# EAGLE design servo-pwm (EAGLE 7.0.0)
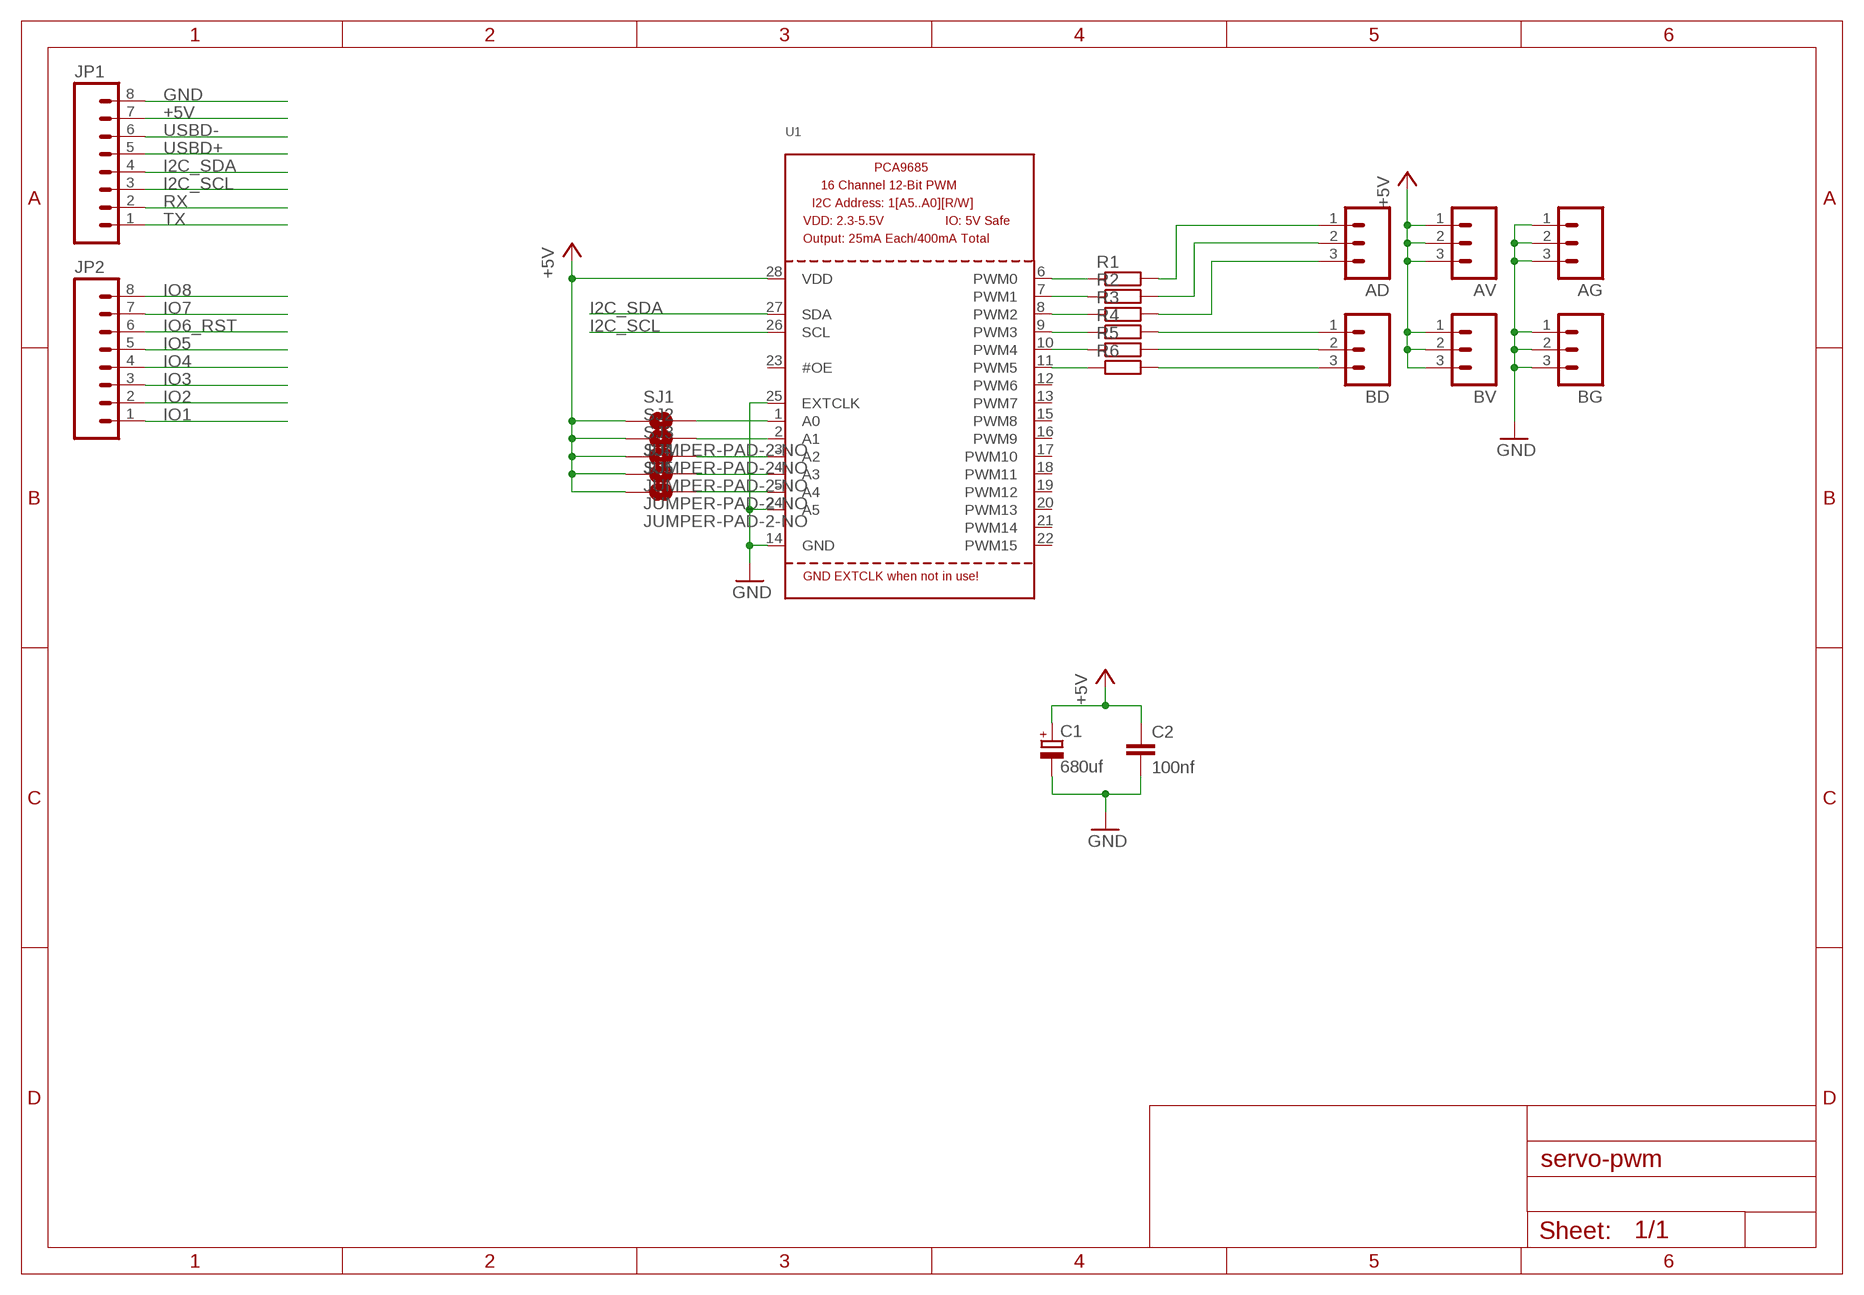
[diagram p0: schematic, sheet 1]

## Parts
AD  M03LOCK  [1X03_LOCK]
AG  M03LOCK  [1X03_LOCK]
AV  M03LOCK  [1X03_LOCK]
BD  M03LOCK  [1X03_LOCK]
BG  M03LOCK  [1X03_LOCK]
BV  M03LOCK  [1X03_LOCK]
C1  680uf  CPOL-EUE2.5-7  [E2,5-7]
C2  100nf  C-EU025-030X050  [C025-030X050]
JP1  M081X08  [1X08]
JP2  M081X08  [1X08]
R1  R-EU_M0805  [M0805]
R2  R-EU_M0805  [M0805]
R3  R-EU_M0805  [M0805]
R4  R-EU_M0805  [M0805]
R5  R-EU_M0805  [M0805]
R6  R-EU_M0805  [M0805]
SJ1  JUMPER-PAD-2-NO  [PAD-JUMPER-2-NO_NO_SILK]
SJ2  JUMPER-PAD-2-NO  [PAD-JUMPER-2-NO_NO_SILK]
SJ3  JUMPER-PAD-2-NO  [PAD-JUMPER-2-NO_NO_SILK]
SJ4  JUMPER-PAD-2-NO  [PAD-JUMPER-2-NO_NO_SILK]
SJ5  JUMPER-PAD-2-NO  [PAD-JUMPER-2-NO_NO_SILK]
U1  PCA9685  [TSSOP28]

## Nets
+5V: AV.1 AV.2 AV.3 BV.1 BV.2 BV.3 C1.+ C2.1 JP1.7 SJ1.1 SJ2.1 SJ3.1 SJ4.1 SJ5.1 U1.28(VDD)
GND: AG.1 AG.2 AG.3 BG.1 BG.2 BG.3 C1.- C2.2 JP1.8 U1.14(GND) U1.24(A5) U1.25(EXTCLK)
I2C_SCL: JP1.3 U1.26(SCL)
I2C_SDA: JP1.4 U1.27(SDA)
IO1: JP2.1
IO2: JP2.2
IO3: JP2.3
IO4: JP2.4
IO5: JP2.5
IO6_RST: JP2.6
IO7: JP2.7
IO8: JP2.8
N$1: R4.1 U1.9(PWM3)
N$2: R5.1 U1.10(PWM4)
N$3: R6.1 U1.11(PWM5)
N$5: BD.3 R6.2
N$6: AD.3 R3.2
N$7: AD.2 R2.2
N$8: AD.1 R1.2
N$9: BD.2 R5.2
N$10: BD.1 R4.2
N$11: SJ1.2 U1.1(A0)
N$12: SJ2.2 U1.2(A1)
N$13: SJ5.2 U1.5(A4)
N$14: SJ3.2 U1.3(A2)
N$15: SJ4.2 U1.4(A3)
N$33: R3.1 U1.8(PWM2)
N$34: R2.1 U1.7(PWM1)
N$35: R1.1 U1.6(PWM0)
RX: JP1.2
TX: JP1.1
USBD+: JP1.5
USBD-: JP1.6
Unconnected: U1.12(PWM6) U1.13(PWM7) U1.15(PWM8) U1.16(PWM9) U1.17(PWM10) U1.18(PWM11) U1.19(PWM12) U1.20(PWM13) U1.21(PWM14) U1.22(PWM15) U1.23(#OE)

## Library data of the parts
AD AG AV BD BG BV = SparkFun-Connectors:M03: Header 3 Standard 3-pin 0.1" header. Use with straight break away headers (SKU : PRT-00116), right angle break away headers (PRT-00553), swiss pins (PRT-00743), machine pins (PRT-00117), and female headers (PRT-00115). Molex polarized connector foot print use with SKU : PRT-08232 with associated crimp pins and housings.
C1 = rcl:CPOL-EU: POLARIZED CAPACITOR, European symbol
C2 = rcl:C-EU: CAPACITOR, European symbol
JP1 JP2 = SparkFun-Connectors:M08: Header 8 Standard 8-pin 0.1" header. Use with straight break away headers (SKU : PRT-00116), right angle break away headers (PRT-00553), swiss pins (PRT-00743), machine pins (PRT-00117), and female headers (PRT-00115).
R1-R6 = rcl:R-EU_: RESISTOR, European symbol
SJ1-SJ5 = SparkFun-Passives:JUMPER-PAD-2-NO
U1 = adafruit:PCA9685: PCA9685 - 16 Channel 12-Bit I2C PWM Controller 5.0V tolerant 16 channel, 12-bit I2C PWM controller with 25mA per output (max. 400mA total) Digikey: 568-5931-1-ND

## Board
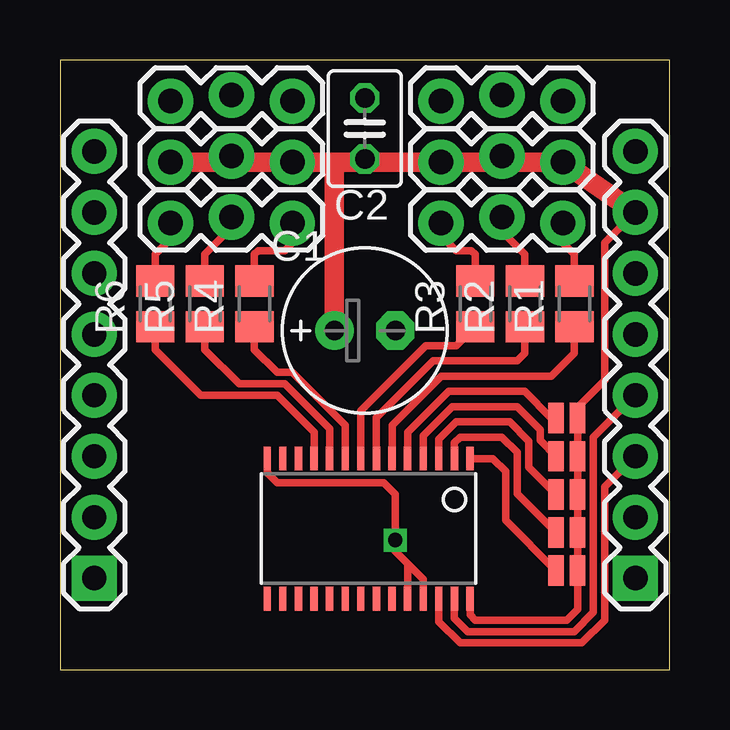
[diagram p1: board, top side]
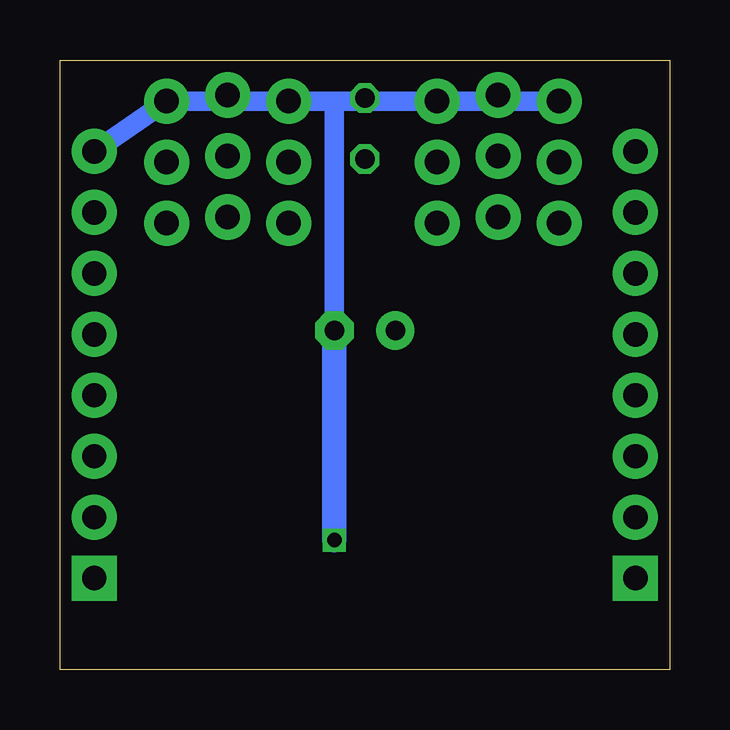
[diagram p2: board, bottom side, seen from below]

Size 25.4 x 25.4 mm. Coordinates in mm from the lower left corner, seen from the top.
Outline: 0,0 25.4,0 25.4,25.4 0,25.4 0,0
Copper layers (1*16): Top 0.0356mm / dielectric 1.5011mm / Bottom 0.0356mm
Design rules "LaenPCBOrder": minimum track width 6mil, minimum drill 13mil, track to track 6mil, track to pad 6mil, pad to pad 6mil, via to via 6mil, smd to smd 6mil, copper to edge 15mil, drill to drill 6mil, minimum pad ring 7mil, minimum via ring 7mil, stop-mask expansion 3mil, vias tented up to drill 0mil, thermal gap 10mil

### Footprints (pad centres in the part's own frame; a part is rotated, then mirrored left to right if it is on the bottom)
1X03_LOCK = drill 1.016 pad 1.88: 1 0,0.127; 2 2.54,-0.127; 3 5.08,0.127
E2,5-7 = drill 0.813 pad 1.6: + -1.27,0 | drill 0.813 pad 1.6 octagon: - 1.27,0
C025-030X050 = drill 0.813 octagon: 1 -1.27,0; 2 1.27,0
1X08 = drill 1.016 pad 1.88 square: 1 0,0 | drill 1.016 pad 1.88: 2 2.54,0; 3 5.08,0; 4 7.62,0; 5 10.16,0; 6 12.7,0; 7 15.24,0; 8 17.78,0
M0805 = smd 1.3 x 1.6: 1 -0.95,0; 2 0.95,0
PAD-JUMPER-2-NO_NO_SILK = smd 0.635 x 1.27: 1 -0.45,0; 2 0.45,0
TSSOP28 = smd 0.305 x 0.991: 1 -4.225,-2.918; 2 -3.575,-2.918; 3 -2.925,-2.918; 4 -2.275,-2.918; 5 -1.625,-2.918; 6 -0.975,-2.918; 7 -0.325,-2.918; 8 0.325,-2.918; 9 0.975,-2.918; 10 1.625,-2.918; 11 2.275,-2.918; 12 2.925,-2.918; 13 3.575,-2.918; 14 4.225,-2.918; 15 4.225,2.918; 16 3.575,2.918; 17 2.925,2.918; 18 2.275,2.918; 19 1.625,2.918; 20 0.975,2.918; 21 0.325,2.918; 22 -0.325,2.918; 23 -0.975,2.918; 24 -1.625,2.918; 25 -2.275,2.918; 26 -2.925,2.918; 27 -3.575,2.918; 28 -4.225,2.918

### Placement (x,y rotation side)
AD  20.95,18.73 180 top
AG  9.68,23.81 180 top
AV  9.68,21.27 180 top
BD  9.68,18.73 180 top
BG  20.95,23.81 180 top
BV  20.95,21.27 180 top
C1  12.7,14.13 0 top
C2  12.7,22.54 90 top
JP1  23.97,3.81 90 top
JP2  1.43,3.81 90 top
R1  21.43,15.24 90 top
R2  19.37,15.24 90 top
R3  17.3,15.24 90 top
R4  8.1,15.24 90 top
R5  6.03,15.24 90 top
R6  3.97,15.24 90 top
SJ1  21.11,4.13 180 top
SJ2  21.11,5.71 180 top
SJ3  21.11,7.3 180 top
SJ4  21.11,8.89 180 top
SJ5  21.11,10.48 180 top
U1  12.86,5.87 180 top

### Tracks (layer width: path | path; a pad name or v marks a point on that pad's centre or on a via)
+5V
  Top 0.305: U1.28 17.08,2.28 17.3,2.06 21.11,2.06 21.56,2.51 SJ1.1 SJ2.1 SJ3.1 SJ4.1 SJ5.1 21.56,10.93 22.7,12.06 22.7,17.78 JP1.7
  Top 0.813: AV.3 6.99,21.14 | 6.99,21.14 AV.1 11.43,21.14 | 11.43,21.14 12.38,21.14 | 12.38,21.14 BV.3 18.57,21.14 | 18.57,21.14 BV.1 JP1.7 | BV.2 18.57,21.14 | C2.1 12.38,21.14 | AV.2 6.99,21.14 | C1.+ 11.43,21.14
GND  (via drill 0.6)
  Top 0.305: 14.48,4.41 13.97,4.92 v13.97,5.4 13.97,7.3 13.49,7.78 9.05,7.78 8.63,8.19 U1.14 | 14.48,4.41 15.13,3.76 U1.25 | U1.24 14.48,4.41
  Bottom 0.813: AG.3 6.83,23.69 | 6.83,23.69 AG.1 12.54,23.69 | 12.54,23.69 13.97,23.69 | 13.97,23.69 BG.3 17.94,23.69 | 17.94,23.69 BG.1 JP1.8 | C2.2 12.54,23.69 | AG.2 6.83,23.69 | BG.2 17.94,23.69 | C1.- 13.97,23.69
  Bottom 1.016: C1.- v13.97,5.4
I2C_SCL
  Top 0.305: U1.26 15.78,2 16.67,1.11 21.75,1.11 22.7,2.06 22.7,7.62 JP1.3
I2C_SDA
  Top 0.305: U1.27 16.43,2.14 16.99,1.59 21.43,1.59 22.23,2.38 22.23,9.68 JP1.4
N$1
  Top 0.305: U1.9 11.88,10.18 9.68,12.38 9.05,12.38 8.1,13.34 R4.1 8.26,14.13
N$2
  Top 0.305: U1.10 11.23,10.04 9.37,11.91 7.46,11.91 6.03,13.34 R5.1
N$3
  Top 0.305: U1.11 10.58,9.89 9.05,11.43 5.87,11.43 3.97,13.34 R6.1
N$5
  Top 0.305: BD.3 4.6,17.94 3.97,17.3 R6.2
N$6
  Top 0.305: AD.3 15.88,18.1 16.51,17.46 17.14,17.46 17.3,17.3 R3.2
N$7
  Top 0.305: AD.2 18.41,18.26 19.37,17.3 R2.2
N$8
  Top 0.305: AD.1 20.95,17.78 21.43,17.3 R1.2
N$9
  Top 0.305: BD.2 7.14,18.41 6.03,17.3 R5.2
N$10
  Top 0.305: BD.1 9.68,17.78 9.37,17.46 8.26,17.46 8.1,17.3 R4.2
N$11
  Top 0.305: U1.1 18.04,8.79 18.57,8.26 18.57,6.22 SJ1.2
N$12
  Top 0.305: U1.2 16.43,9.45 16.67,9.68 18.41,9.68 19.05,9.05 19.05,7.33 SJ2.2
N$13
  Top 0.305: U1.5 14.48,9.88 16.19,11.59 19.37,11.59 20.48,10.48 SJ5.2
N$14
  Top 0.305: U1.3 15.78,9.59 16.51,10.32 18.73,10.32 19.53,9.53 19.53,8.44 SJ3.2
N$15
  Top 0.305: U1.4 15.13,9.74 16.35,10.95 19.05,10.95 20,10 20,9.55 SJ4.2
N$33
  Top 0.305: U1.8 12.53,10.79 15.24,13.49 16.51,13.49 R3.1
N$34
  Top 0.305: U1.7 13.18,10.48 15.56,12.86 19.05,12.86 19.37,13.18 R2.1
N$35
  Top 0.305: U1.6 13.83,10.18 15.88,12.22 20.48,12.22 21.43,13.18 R1.1